# Altium schematic sheet PowerMonitor.SchDoc: Power Monitors
size A3; Engineer: M. Wenke; DocumentNumber: CRSC0008; SheetNumber: 1; SheetTotal: 1; Version: 1.0; DocumentName: Power Monitors
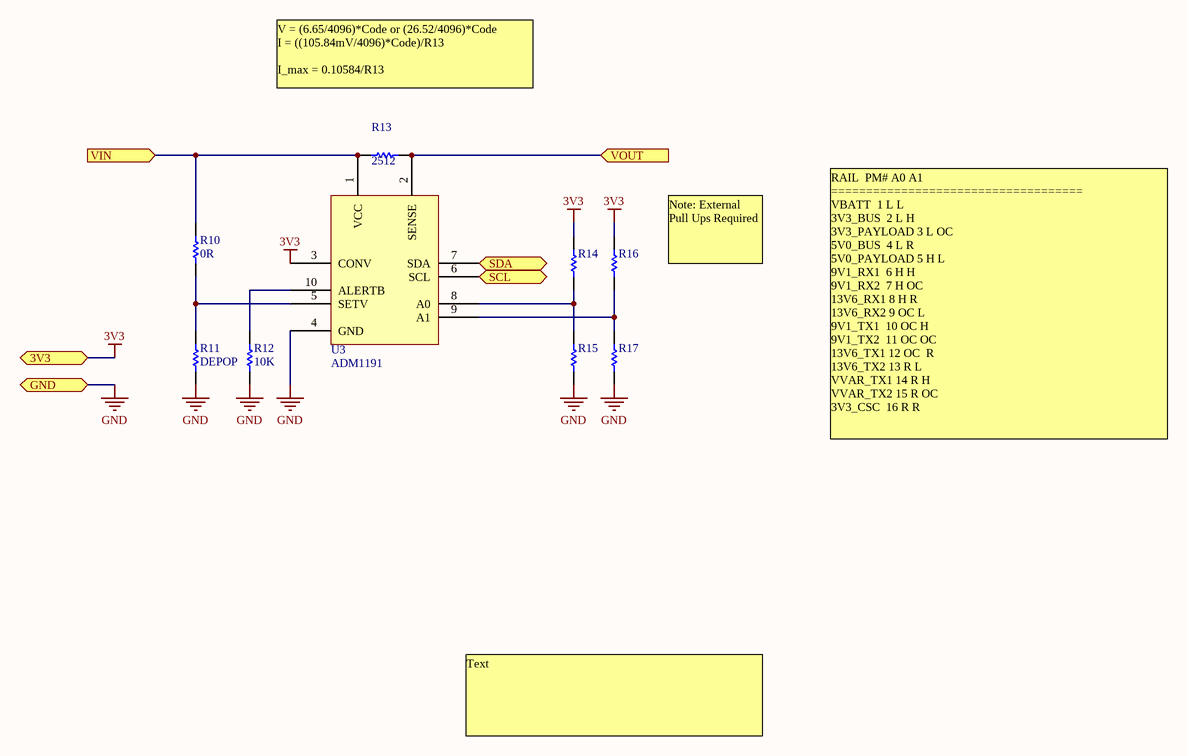
[diagram p0: PowerMonitor.SchDoc]

## Parts
R10  value 0R  [R0402M]
R11  value DEPOP  [R0402M]
R12  value 10K  [R0402M]
R13  Footprint: 2512  [2515 Resistor]
R14  (no value)  [R0402M]
R15  (no value)  [R0402M]
R16  (no value)  [R0402M]
R17  (no value)  [R0402M]
U3  ADM1191  [ADM1191]

## Ports
3V3, GND, SCL (in), SDA (bidir), VIN (in), VOUT (in)

## Nets
3V3: R14.1 R16.1 U3.3(CONV) ; port 3V3
GND: R11.2 R12.2 R15.2 R17.2 U3.4(GND) ; port GND
SCL: U3.6(SCL) ; port SCL
SDA: U3.7(SDA) ; port SDA
VIN: R10.1 R13.2 U3.1(VCC) ; port VIN
VOUT: R13.1 U3.2(SENSE) ; port VOUT
NetR10_2: R10.2 R11.1 U3.5(SETV)
NetR12_1: R12.1 U3.10(ALERTB)
NetR14_2: R14.2 R15.1 U3.8(A0)
NetR16_2: R16.2 R17.1 U3.9(A1)

## Notes on the sheet
- V = (6.65/4096)*Code or (26.52/4096)*Code
  I = ((105.84mV/4096)*Code)/R13
  I_max = 0.10584/R13
- Note: External Pull Ups Required
- RAIL		PM#	A0	A1
  ====================================
  VBATT		1	L	L
  3V3_BUS		2	L	H
  3V3_PAYLOAD	3	L	OC
  5V0_BUS		4	L	R
  5V0_PAYLOAD	5	H	L
  9V1_RX1		6	H	H
  9V1_RX2		7	H	OC
  13V6_RX1	8	H	R
  13V6_RX2	9	OC	L
  9V1_TX1		10	OC	H
  9V1_TX2		11	OC	OC
  13V6_TX1	12	OC 	R
  13V6_TX2	13	R	L
  VVAR_TX1	14	R	H
  VVAR_TX2	15	R	OC
  3V3_CSC		16	R	R
- Text
- Title
- Description:
- Size:
- Author:
- Date:
- A3
- Time:
- Version
- Sheet:
- Drawing No.:
- of
- File:

## Library data of the parts
R10-R12 = Res1: Resistor; Published: 8-Jun-2000; LatestRevisionDate: 17-Jul-2002; LatestRevisionNote: Re-released for DXP Platform.; PackageReference: AXIAL-0.3; Publisher: Altium Limited; PackageDescription: Axial Device, Thru-Hole; 2 Leads; 0.3 in Pin Spacing
R13-R17 = Res1: Resistor; Value: 1K; Published: 8-Jun-2000; LatestRevisionDate: 17-Jul-2002; LatestRevisionNote: Re-released for DXP Platform.; PackageReference: AXIAL-0.3; Publisher: Altium Limited; PackageDescription: Axial Device, Thru-Hole; 2 Leads; 0.3 in Pin Spacing